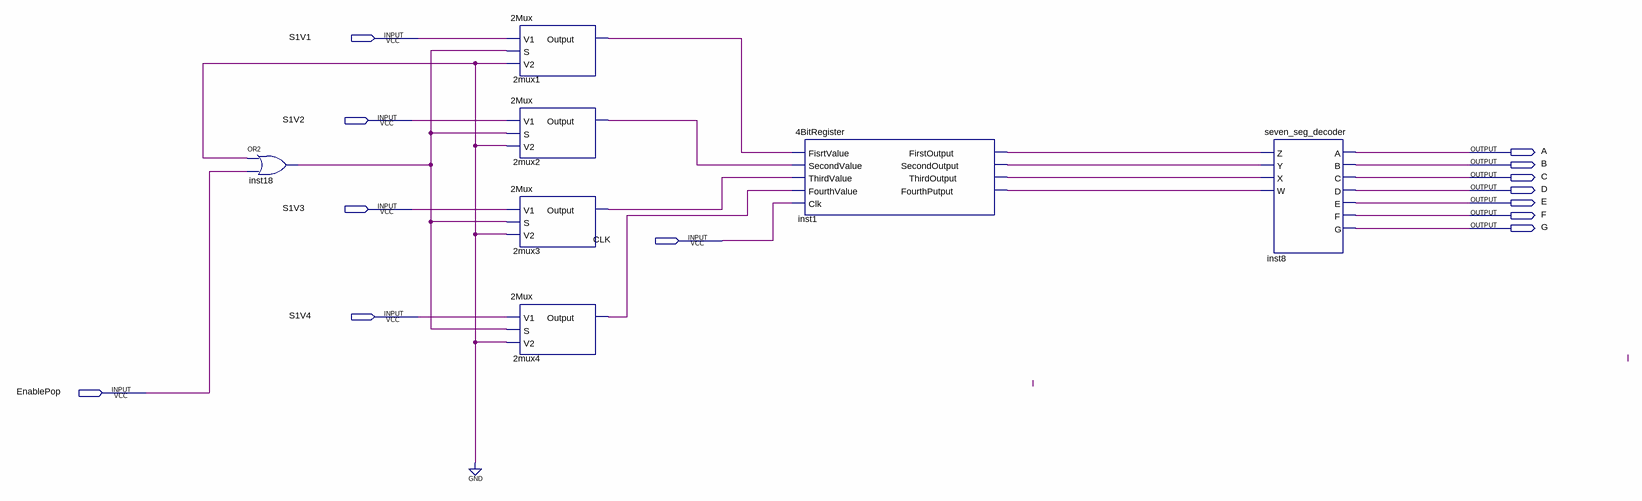
[diagram p0: schematic sheet]
// Quartus schematic fregister1.bdf as structural Verilog: 7 symbols, 13 pins
module fregister1 (
  input  S1V1,
  input  S1V2,
  input  S1V3,
  input  CLK,
  input  S1V4,
  input  EnablePop,
  output A,
  output B,
  output C,
  output D,
  output E,
  output F,
  output G
);

  wire inst1_firstoutput, inst1_fourthputput, inst1_secondoutput, inst1_thirdoutput, inst18_out,
       n2mux1_output, n2mux2_output, n2mux3_output, n2mux4_output;

  or inst18 (inst18_out, 1'b0, EnablePop);
  \2Mux  u_2mux1 (.V1(S1V1), .S(inst18_out), .V2(1'b0), .Output(n2mux1_output));
  \2Mux  u_2mux2 (.V1(S1V2), .S(inst18_out), .V2(1'b0), .Output(n2mux2_output));
  \2Mux  u_2mux3 (.V1(S1V3), .S(inst18_out), .V2(1'b0), .Output(n2mux3_output));
  \2Mux  u_2mux4 (.V1(S1V4), .S(inst18_out), .V2(1'b0), .Output(n2mux4_output));
  \4BitRegister  inst1 (
    .FisrtValue(n2mux1_output), .SecondValue(n2mux2_output), .ThirdValue(n2mux3_output),
    .FourthValue(n2mux4_output), .Clk(CLK), .FirstOutput(inst1_firstoutput),
    .SecondOutput(inst1_secondoutput), .ThirdOutput(inst1_thirdoutput), .FourthPutput(inst1_fourthputput));
  seven_seg_decoder inst8 (
    .Z(inst1_firstoutput), .Y(inst1_secondoutput), .X(inst1_thirdoutput), .W(inst1_fourthputput), .A(A),
    .B(B), .C(C), .D(D), .E(E), .F(F), .G(G));
endmodule
